# EasyEDA schematic brake.json
TITLE: Sheet_1; REV: 1.0; Date: 2020-07-05; Sheet: 1/1; Drawn By: patrick910826; Company: Your Company
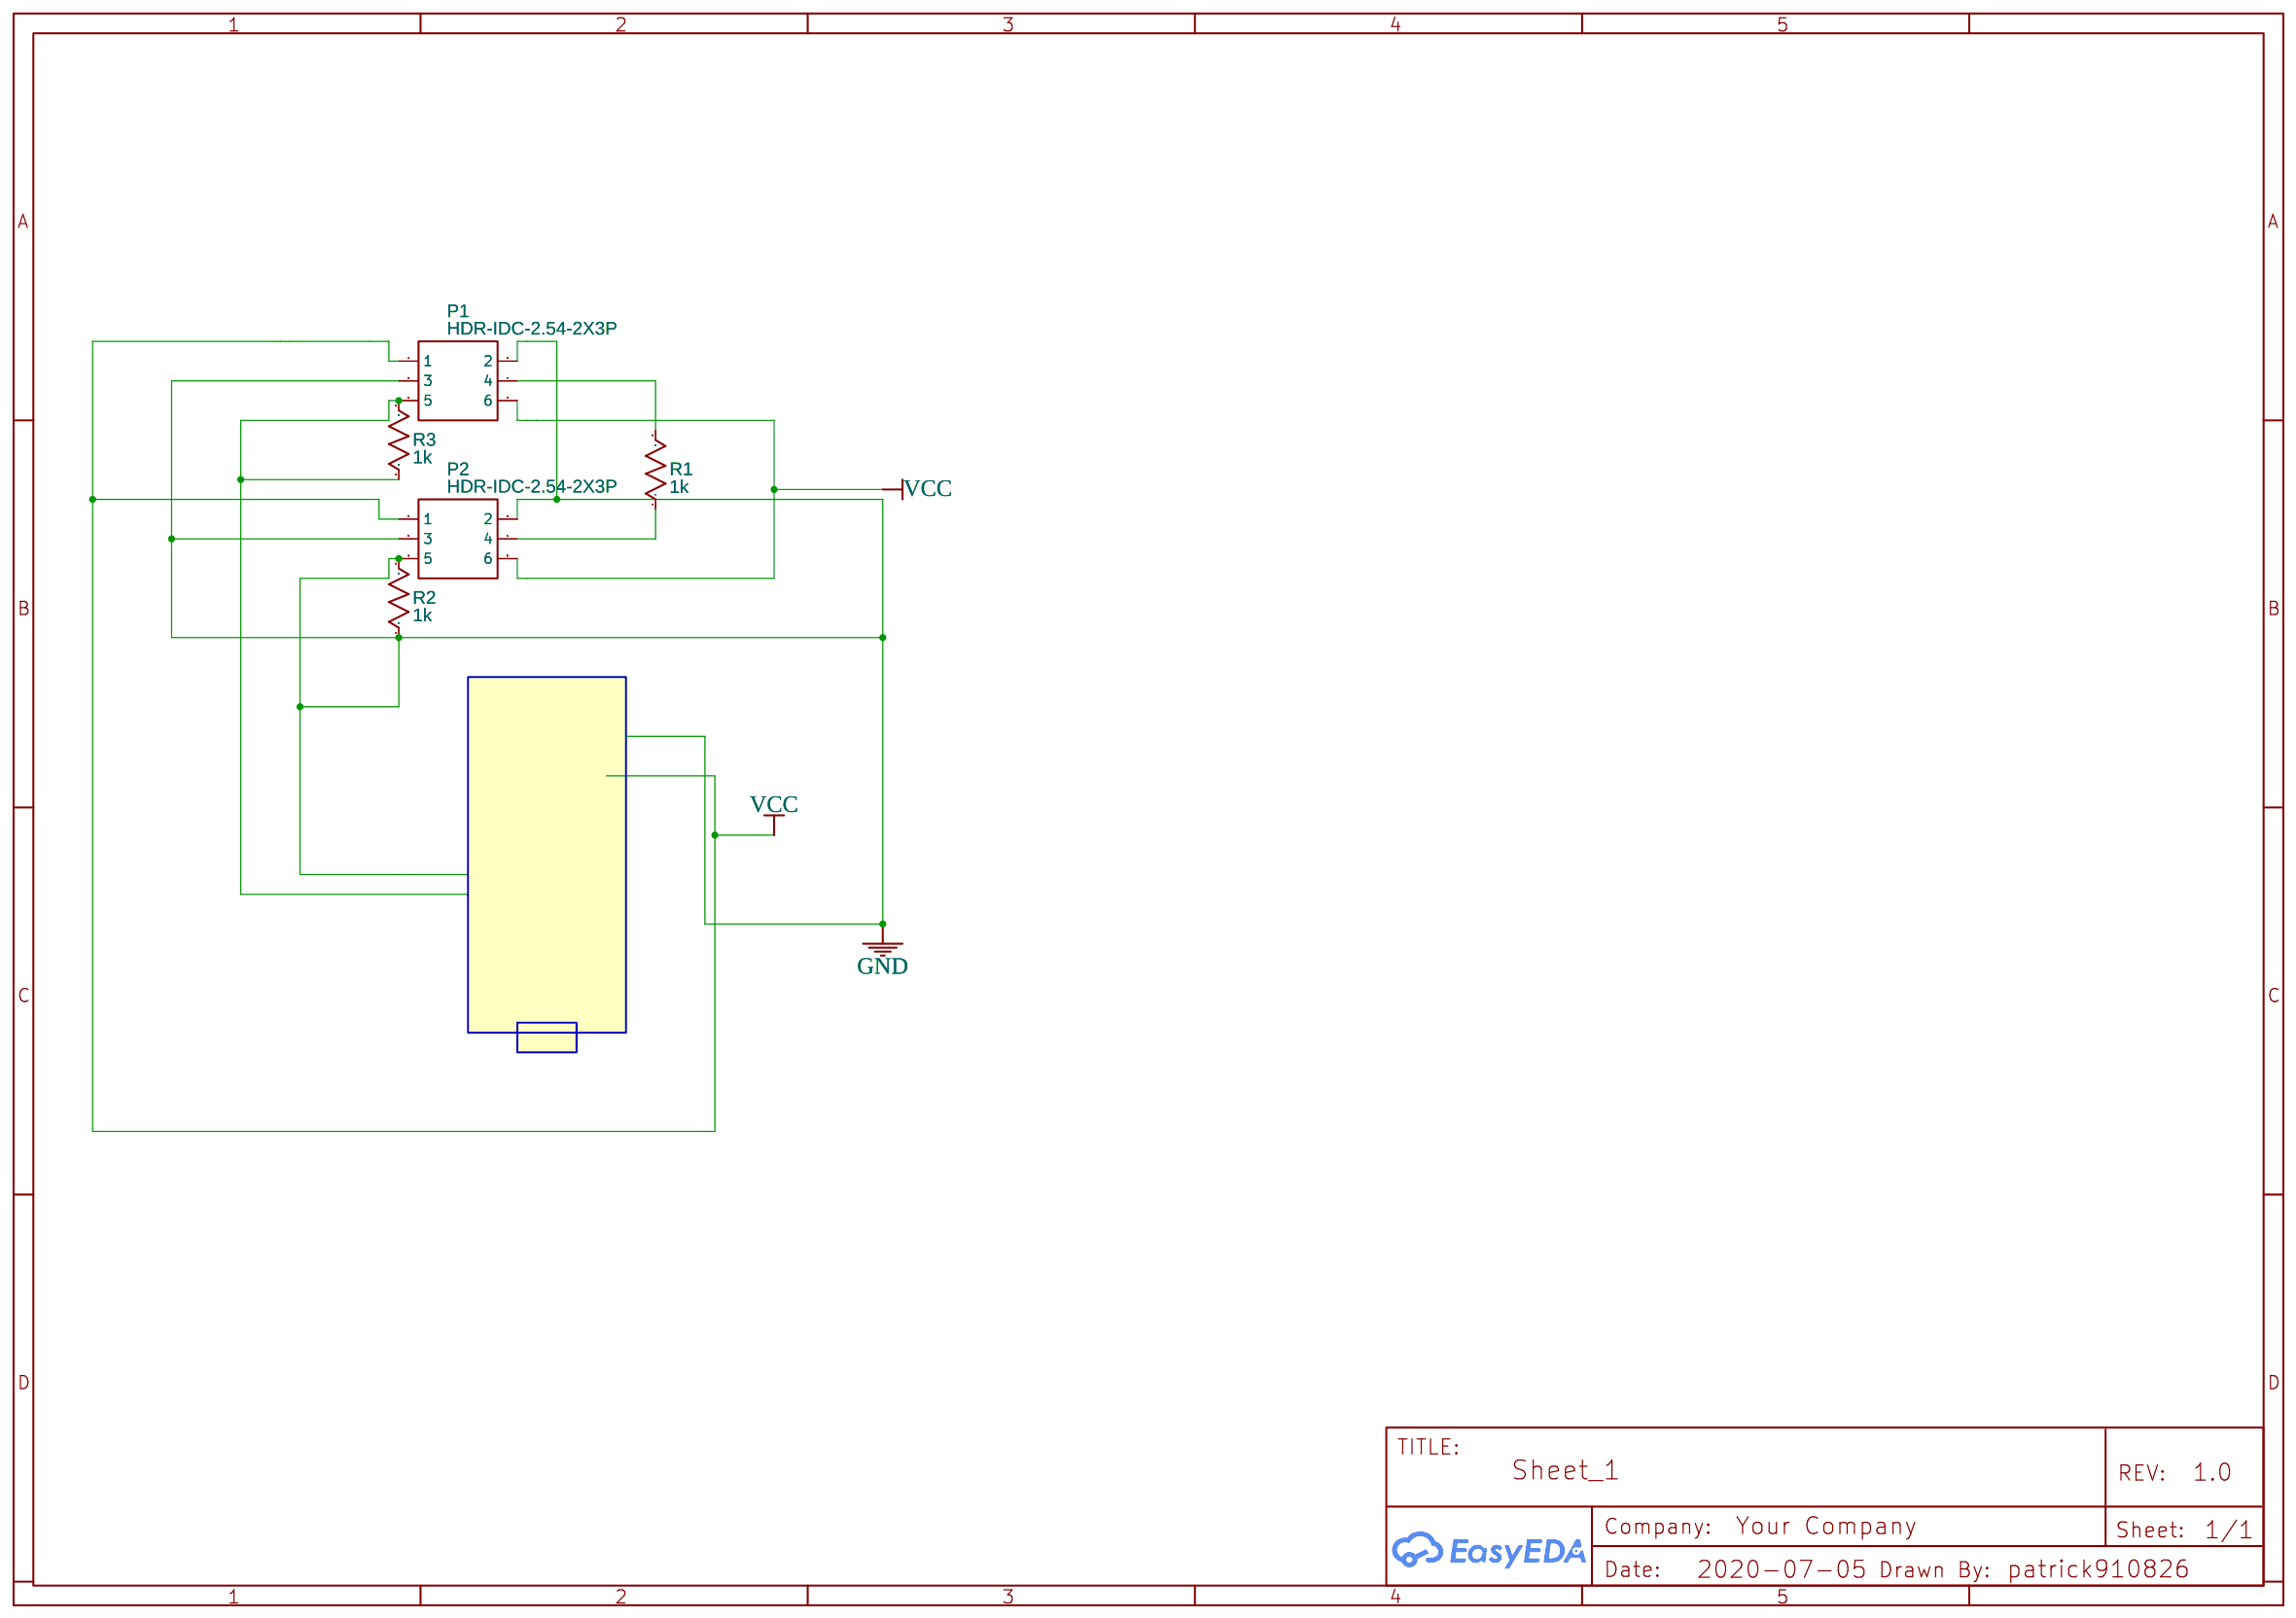
[diagram p0: schematic sheet]

## Parts
P1  HDR-IDC-2.54-2X3P  [IDC-TH_6P-P2.54_C11214]
P2  HDR-IDC-2.54-2X3P  [IDC-TH_6P-P2.54_C11214]
R1  1k  [R_AXIAL-0.5]
R2  1k  [R_AXIAL-0.5]
R3  1k  [R_AXIAL-0.5]

## Library data of the parts
P1 P2 = HDR-IDC-2.54-2X3P: Supplier: LCSC; Manufacturer: BOOMELE; Manufacturer Part: 2X3 2.54mm IDC Box; image: //image.lceda.cn/szlcsc/C11214.jpg; Supplier Part: C11214
R1-R3 = R_AXIAL-0.5_US: Contributor: LCEDA_Lib

## Nets
GND: P1.2 P1.3 P2.2 P2.3 P2.5 R2.1 R2.2
VCC: P1.1 P1.6 P2.1 P2.6
Net-(P1-4): P1.4 R1.2
Net-(P1-5): P1.5 R3.1 R3.2
Net-(P2-4): P2.4 R1.1
